# Altium schematic sheet RS485.SchDoc
size A3; SheetNumber: 6; SheetTotal: 10
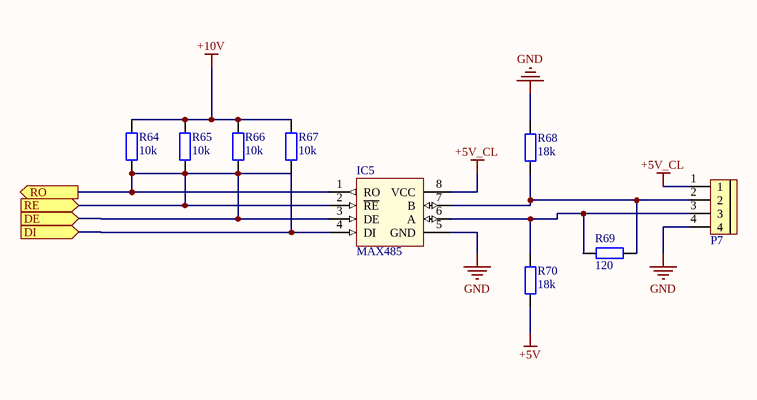
[diagram p0: RS485.SchDoc]

## Parts
IC5  MAX485  [SO-8N]
P7  CON 4 EDG5.08  [CON 4 4EDG5.08]  (value not drawn)
R64  10k  [tro smd 0805]
R65  10k  [tro smd 0805]
R66  10k  [tro smd 0805]
R67  10k  [tro smd 0805]
R68  18k  [tro smd 0805]
R69  120  [tro smd 0805]
R70  18k  [tro smd 0805]

## Ports
DE (in), DI (in), RE (in), RO (out)

## Nets
+5V: R70.1
+5V_CL: IC5.8(VCC) P7.1
+10V: R64.2 R65.2 R66.2 R67.2
GND: IC5.5(GND) P7.4 R68.2
DE: IC5.1(RO) IC5.2(~{RE}) IC5.3(DE) IC5.4(DI) R64.1 R65.1 R66.1 R67.1 ; port RO, port RE, port DE, port DI
NetIC5_6: IC5.6(A) P7.3 R69.1 R70.2
NetIC5_7: IC5.7(B) P7.2 R68.1 R69.2

## Library data of the parts
IC5 = MAX485: RS232 - RS485 (Same sn75176)
P7 = CON 4 EDG5.08: Cắm; Ten_Linh_Kien: CON 4 2EDG5.08-4P 5.08MM ( Xanh Cong); Ma_Hang: MH000979; Don_Vi: Con; Ghi_Chu: *; Kieu_Chan: *; Chung_Loai: Cắm
R64-R67 = Tro 0805 1% 10k: Dán; Don_Vi: Con; So_Chan: 2; Ten_Linh_Kien: Trở 0805 1% 10k; Ma_Hang: MH005473; Chung_Loai: Dán; Kieu_Chan: *
R68 R70 = Tro 0805 1% 18k: Dán; Don_Vi: Con; So_Chan: 2; Ten_Linh_Kien: Trở 0805 1% 18k; Ma_Hang: MH005477; Chung_Loai: Dán; Kieu_Chan: *
R69 = Tro 0805 1% 12k: Dán; Don_Vi: Con; So_Chan: 2; Ten_Linh_Kien: Trở 0805 1% 12k; Ma_Hang: MH005475; Chung_Loai: Dán; Kieu_Chan: *